# EAGLE design micro_RevB-328 (EAGLE 6.5.0)
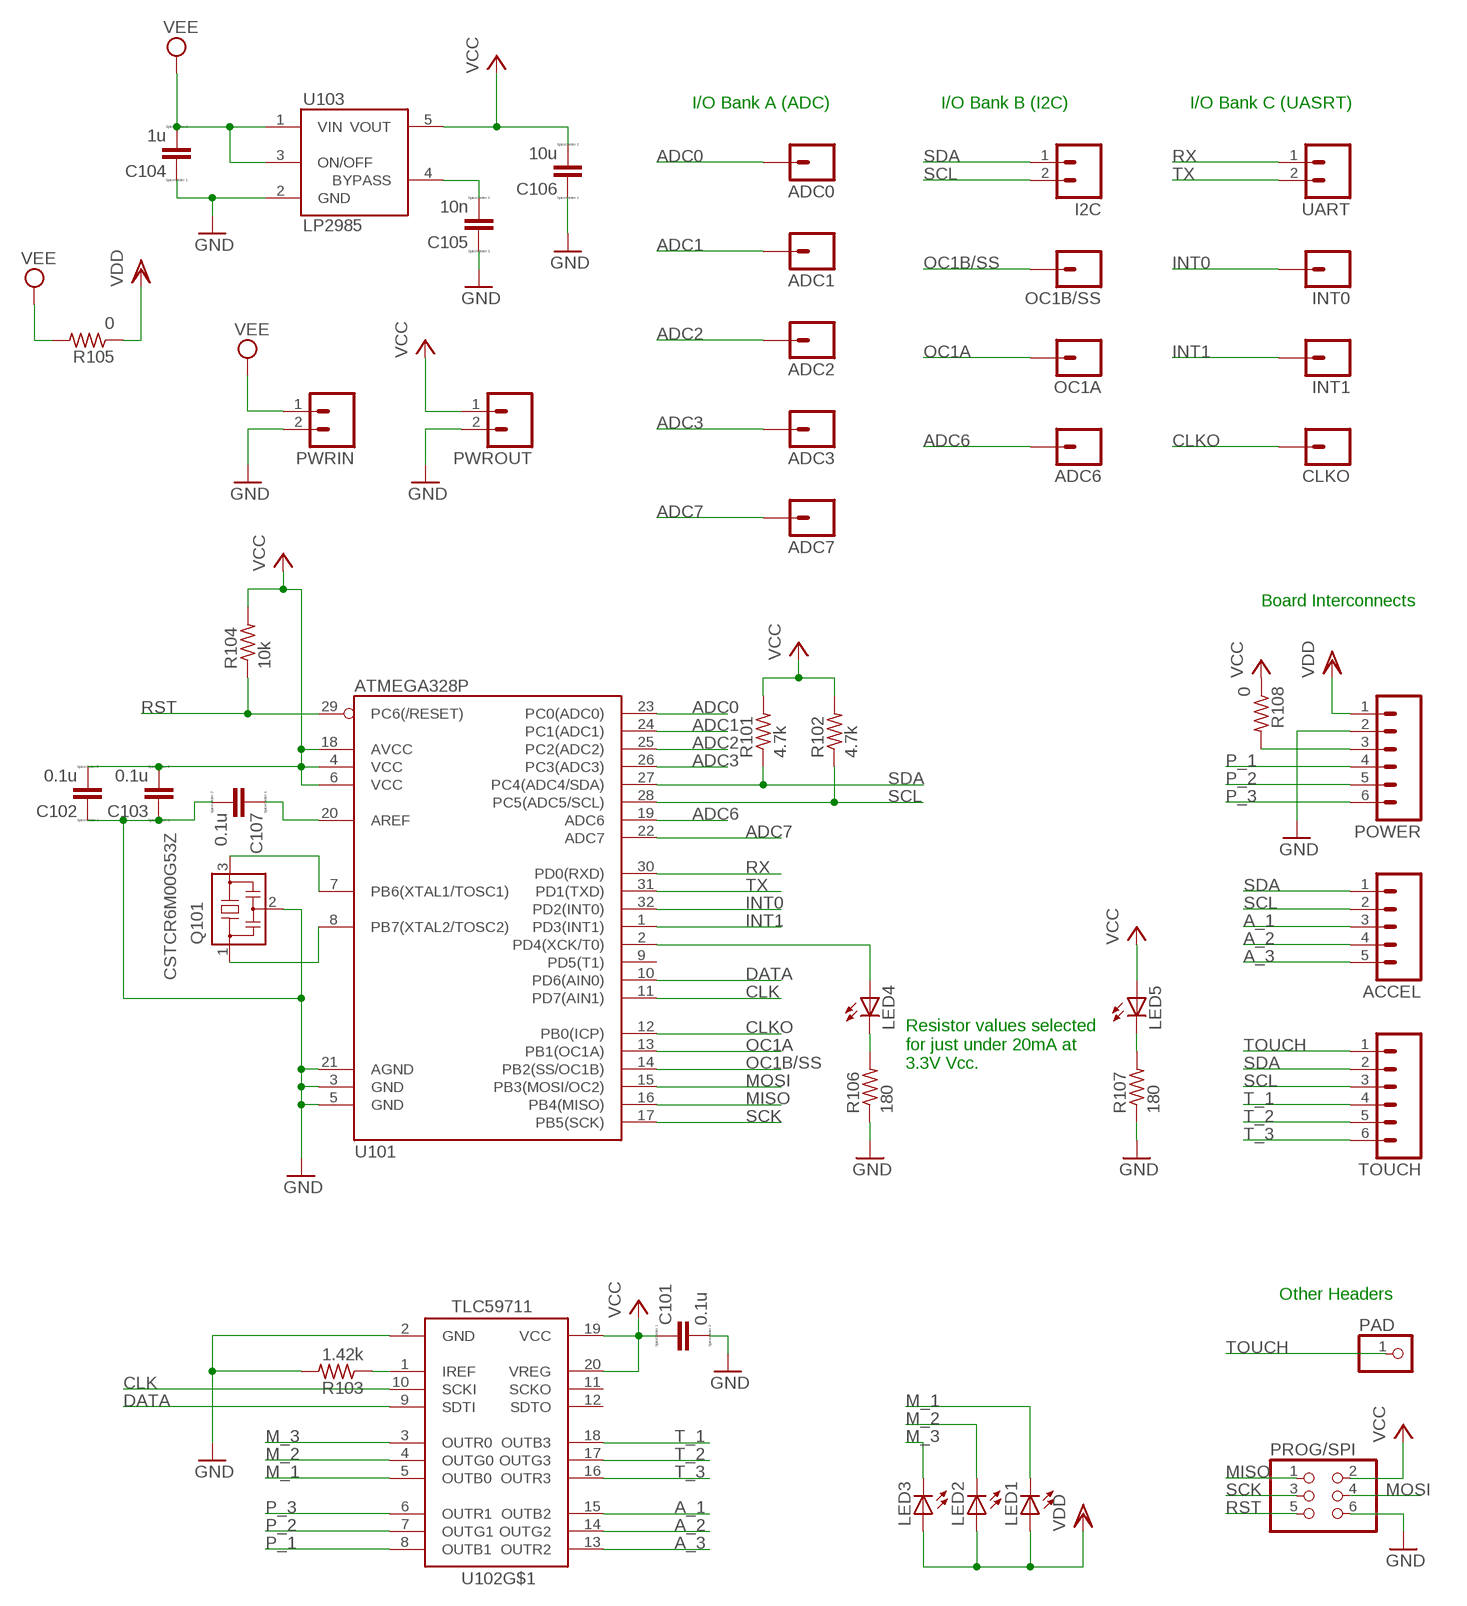
[diagram p0: schematic, sheet 1]

## Parts
ACCEL  M05LOCK  [1X05_LOCK]
ADC0  M01PTH  [1X01]
ADC1  M01PTH  [1X01]
ADC2  M01PTH  [1X01]
ADC3  M01PTH  [1X01]
ADC6  M01PTH  [1X01]
ADC7  M01PTH  [1X01]
C101  0.1u  CC0603  [C0603]
C102  0.1u  CC0603  [C0603]
C103  0.1u  CC0603  [C0603]
C104  1u  CC0603  [C0603]
C105  10n  CC0603  [C0603]
C106  10u  CC0603  [C0603]
C107  0.1u  CC0603  [C0603]
CLKO  M01PTH  [1X01]
I2C  M02LOCK  [1X02_LOCK]
INT0  M01PTH  [1X01]
INT1  M01PTH  [1X01]
LED1  LEDP-LCC-4  [P-LCC-4]
LED2  LEDP-LCC-4  [P-LCC-4]
LED3  LEDP-LCC-4  [P-LCC-4]
LED4  LEDSML0603  [SML0603]
LED5  LEDSML0603  [SML0603]
OC1A  M01PTH  [1X01]
OC1B/SS  M01PTH  [1X01]
PAD  PINHD-1X1  [1X01]
POWER  M06SIP_LOCK  [1X06-SIP_LOCK]
PROG/SPI  PINHD-2X3  [2X03]
PWRIN  M02LOCK  [1X02_LOCK]
PWROUT  M02LOCK  [1X02_LOCK]
Q101  CSTCR6M00G53Z  [CSTCR6M]
R101  4.7k  R-US_R0603  [R0603]
R102  4.7k  R-US_R0603  [R0603]
R103  1.42k  R-US_R0603  [R0603]
R104  10k  R-US_R0603  [R0603]
R105  0  R-US_R0603  [R0603]
R106  180  R-US_R0603  [R0603]
R107  180  R-US_R0603  [R0603]
R108  0  R-US_R0603  [R0603]
TOUCH  M06SIP_LOCK  [1X06-SIP_LOCK]
U101  ATMEGA328P  ATMEGA328_SMT  [TQFP32-08]
U102  TLC59711  [HTSSOP20DAP]
U103  LP2985AIM5-3.3  [SOT25]
UART  M02LOCK  [1X02_LOCK]

## Nets
A_1: ACCEL.3 U102.15(OUTB2)
A_2: ACCEL.4 U102.14(OUTG2)
A_3: ACCEL.5 U102.13(OUTR2)
ADC0: ADC0.1 U101.23(PC0(ADC0))
ADC1: ADC1.1 U101.24(PC1(ADC1))
ADC2: ADC2.1 U101.25(PC2(ADC2))
ADC3: ADC3.1 U101.26(PC3(ADC3))
ADC6: ADC6.1 U101.19(ADC6)
ADC7: ADC7.1 U101.22(ADC7)
BYPASS: C105.2 U103.4(BYPASS)
CLK: U101.11(PD7(AIN1)) U102.10(SCKI)
CLKO: CLKO.1 U101.12(PB0(ICP))
DATA: U101.10(PD6(AIN0)) U102.9(SDTI)
INT0: INT0.1 U101.32(PD2(INT0))
INT1: INT1.1 U101.1(PD3(INT1))
M_1: LED1.C@4(C) U102.5(OUTB0)
M_2: LED2.C@4(C) U102.4(OUTG0)
M_3: LED3.C@4(C) U102.3(OUTR0)
MISO: PROG/SPI.1 U101.16(PB4(MISO))
MOSI: PROG/SPI.4 U101.15(PB3(MOSI/OC2))
N7: C101.2 C102.1 C103.1 C104.1 C105.1 C106.1 C107.2 POWER.2 PROG/SPI.6 PWRIN.2 PWROUT.2 Q101.2 R103.2 R106.1 R107.1 U101.3(GND) U101.5(GND) U101.21(AGND) U102.2(GND) U103.2(GND) ; supply symbol labelled GND
N$1: Q101.1 U101.8(PB7(XTAL2/TOSC2))
N$2: Q101.3 U101.7(PB6(XTAL1/TOSC1))
N$3: LED4.A U101.2(PD4(XCK/T0))
N$4: R103.1 U102.1(IREF)
N$5: POWER.3 R108.2
N$8: LED4.C R106.2
N$10: C107.1 U101.20(AREF)
N$12: LED5.C R107.2
OC1A: OC1A.1 U101.13(PB1(OC1A))
OC1B/SS: OC1B/SS.1 U101.14(PB2(SS/OC1B))
P_1: POWER.4 U102.8(OUTB1)
P_2: POWER.5 U102.7(OUTG1)
P_3: POWER.6 U102.6(OUTR1)
RST: PROG/SPI.5 R104.1 U101.29(PC6(/RESET))
RX: U101.30(PD0(RXD)) UART.1
SCK: PROG/SPI.3 U101.17(PB5(SCK))
SCL: ACCEL.2 I2C.2 R102.1 TOUCH.3 U101.28(PC5(ADC5/SCL))
SDA: ACCEL.1 I2C.1 R101.1 TOUCH.2 U101.27(PC4(ADC4/SDA))
T_1: TOUCH.4 U102.18(OUTB3)
T_2: TOUCH.5 U102.17(OUTG3)
T_3: TOUCH.6 U102.16(OUTR3)
TOUCH: PAD.1 TOUCH.1
TX: U101.31(PD1(TXD)) UART.2
VCC: C101.1 C102.2 C103.2 C106.2 LED5.A PROG/SPI.2 PWROUT.1 R101.2 R102.2 R104.2 R108.1 U101.4(VCC) U101.6(VCC) U101.18(AVCC) U102.19(VCC) U102.20(VREG) U103.5(VOUT)
VDD: LED1.A LED2.A LED3.A POWER.1 R105.1
VEE: C104.2 PWRIN.1 R105.2 U103.1(VIN) U103.3(ON/OFF)
Unconnected: U101.9(PD5(T1)) U102.11(SCKO) U102.12(SDTO) U102.EXP(PAD)

## Notes on the sheet
- I/O Bank A (ADC) | I/O Bank B (I2C) | I/O Bank C (UASRT)
- Board Interconnects
- Resistor values selected 
  for just under 20mA at 
  3.3V Vcc.
- Other Headers

## Library data of the parts
ACCEL = SparkFun-Connectors:M05: Header 5 Standard 5-pin 0.1" header. Use with straight break away headers (SKU : PRT-00116), right angle break away headers (PRT-00553), swiss pins (PRT-00743), machine pins (PRT-00117), and female headers (PRT-00115). Molex polarized connector foot print use with SKU : PRT-08230 with associated crimp pins and housings.
ADC0 ADC1-ADC3 ADC6 ADC7 CLKO INT0 INT1 OC1A OC1B/SS = SparkFun-Connectors:M01: Header 1 Standard 1-pin 0.1" header. Use with straight break away headers (SKU : PRT-00116), right angle break away headers (PRT-00553), swiss pins (PRT-00743), machine pins (PRT-00117), and female headers (PRT-00115).
C101-C107 = eagle-ltspice:C: CAPACITOR, European symbol; SPICEMODEL: NONE; SPICEPREFIX: C
I2C PWRIN PWROUT UART = SparkFun-Connectors:M02: Standard 2-pin 0.1" header. Use with - straight break away headers ( PRT-00116) - right angle break away headers (PRT-00553) - swiss pins (PRT-00743) - machine pins (PRT-00117) - female headers (PRT-00115) Molex polarized connector foot print use with: PRT-08233 with associated crimp pins and housings. 2.54_SCREWTERM for use with PRT-10571. 3.5mm Screw Terminal footprints for PRT-08084 5mm Screw Terminal footprints for use with PRT-08433
LED1-LED5 = led:LED: LED OSRAM: - CHIPLED LG R971, LG N971, LY N971, LG Q971, LY Q971, LO R971, LY R971 LH N974, LH R974 LS Q976, LO Q976, LY Q976 LO Q996 - Hyper CHIPLED LW Q18S LB Q993, LB Q99A, LB R99A - SideLED LS A670, LO A670, LY A670, LG A670, LP A670 LB A673, LV A673, LT A673, LW A673 LH A674 LY A675 LS A676, LA A676, LO A676, LY A676, LW A676 LS A679, LY A679, LG A679 - Hyper Micro SIDELED® LS Y876, LA Y876, LO Y876, LY Y876 LT Y87S - SmartLED LW L88C, LW L88S LB L89C, LB L89S, LG L890 LS L89K, LO L89K, LY L89K LS L896, LA L896, LO L896, LY L896 - TOPLED LS T670, LO T670, LY T670, LG T670, LP T670 LSG T670, LSP T670, LSY T670, LOP T670, LYG T670 LG T671, LOG T671, LSG T671 LB T673, LV T673, LT T673, LW T673 LH T674 LS T676, LA T676, LO T676, LY T676, LB T676, LH T676, LSB T676, LW T676 LB T67C, LV T67C, LT T67C, LS T67K, LO T67K, LY T67K, LW E67C LS E67B, LA E67B, LO E67B, LY E67B, LB E67C, LV E67C, LT E67C LW T67C LS T679, LY T679, LG T679 LS T770, LO T770, LY T770, LG T770, LP T770 LB T773, LV T773, LT T773, LW T773 LH T774 LS E675, LA E675, LY E675, LS T675 LS T776, LA T776, LO T776, LY T776, LB T776 LHGB T686 LT T68C, LB T68C - Hyper Mini TOPLED® LB M676 - Mini TOPLED Santana® LG M470 LS M47K, LO M47K, LY M47K Source: http://www.osram.convergy.de LUXEON: - LUMILED® LXK2-PW12-R00, LXK2-PW12-S00, LXK2-PW14-U00, LXK2-PW14-V00 LXK2-PM12-R00, LXK2-PM12-S00, LXK2-PM14-U00 LXK2-PE12-Q00, LXK2-PE12-R00, LXK2-PE12-S00, LXK2-PE14-T00, LXK2-PE14-U00 LXK2-PB12-K00, LXK2-PB12-L00, LXK2-PB12-M00, LXK2-PB14-N00, LXK2-PB14-P00, LXK2-PB14-Q00 LXK2-PR12-L00, LXK2-PR12-M00, LXK2-PR14-Q00, LXK2-PR14-R00 LXK2-PD12-Q00, LXK2-PD12-R00, LXK2-PD12-S00 LXK2-PH12-R00, LXK2-PH12-S00 LXK2-PL12-P00, LXK2-PL12-Q00, LXK2-PL12-R00 Source: www.luxeon.com KINGBRIGHT: KA-3528ASYC Source: www.kingbright.com
PAD = pinhead:PINHD-1X1: PIN HEADER
POWER TOUCH = SparkFun-Connectors:M06: Header 6 Standard 6-pin 0.1" header. Use with straight break away headers (SKU : PRT-00116), right angle break away headers (PRT-00553), swiss pins (PRT-00743), machine pins (PRT-00117), and female headers (PRT-00115). Molex polarized connector foot print use with SKU : PRT-08094 with associated crimp pins and housings. NOTES ON THE VARIANTS LOCK and LOCK_LONGPADS... This footprint was designed to help hold the alignment of a through-hole component (i.e. 6-pin header) while soldering it into place. You may notice that each hole has been shifted either up or down by 0.005 of an inch from it's more standard position (which is a perfectly straight line). This slight alteration caused the pins (the squares in the middle) to touch the edges of the holes. Because they are alternating, it causes a "brace" to hold the component in place. 0.005 has proven to be the perfect amount of "off-center" position when using our standard breakaway headers. Although looks a little odd when you look at the bare footprint, once you have a header in there, the alteration is very hard to notice. Also,if you push a header all the way into place, it is covered up entirely on the bottom side. This idea of altering the position of holes to aid alignment will be further integrated into the Sparkfun Library for other footprints. It can help hold any component with 3 or more connection pins.
PROG/SPI = SparkFun-Connectors:PINHD-2X3: PIN HEADER
Q101 = murata-filter:CSTCR: Resonator Source: murata.co.jp; MPN: CSTCR6M00G53-R0; OC_FARNELL: 1170434; OC_NEWARK: 25M8759
R101 R102 R104-R108 = rcl:R-US_: RESISTOR, American symbol
R103 = resistor:R-US_: RESISTOR, American symbol
U101 = SparkFun-DigitalIC:ATMEGA328_SMT: 32-Pin Atmega328 part Commonly used on Arduino compatible boards Available in QFP and QFN packages TQFP is IC-09069 QFN is non-stock; PROD_ID: IC-09069
U102 = adafruit:TLC59711
U103 = LP2985:LP2985: LP2985-N Micropower 150 mA Low-Noise Ultra Low-Dropout Regulator

## Board
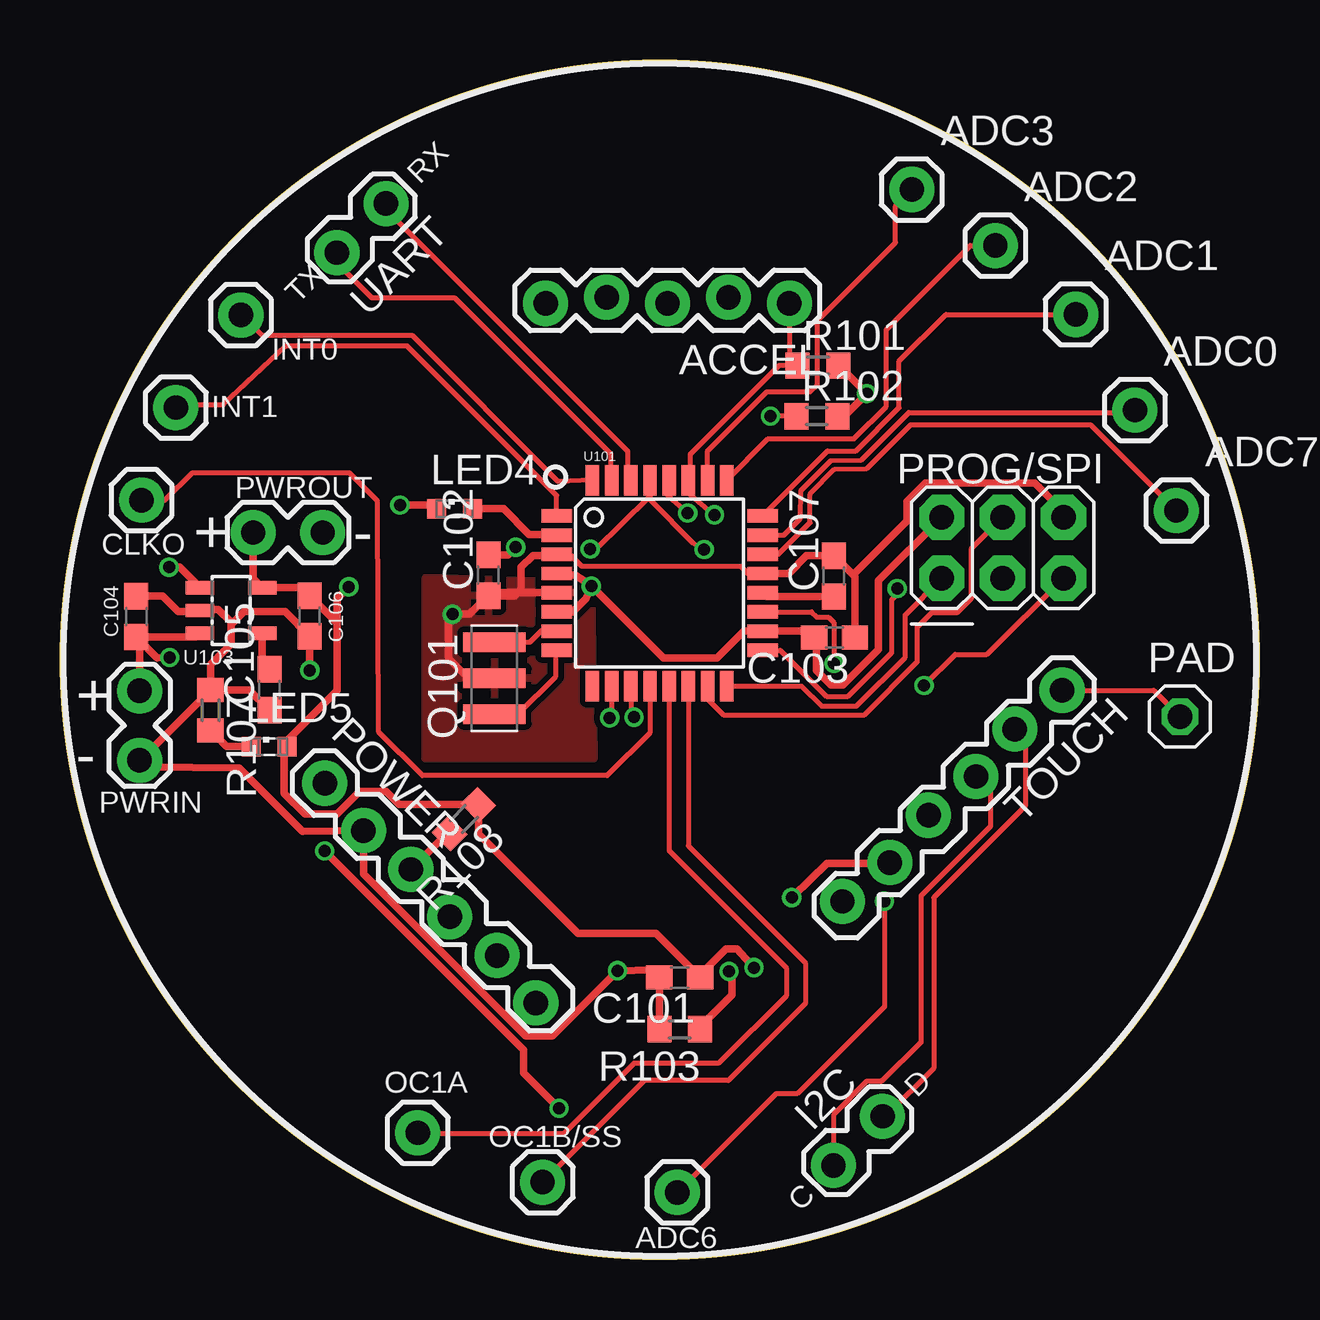
[diagram p1: board, top side]
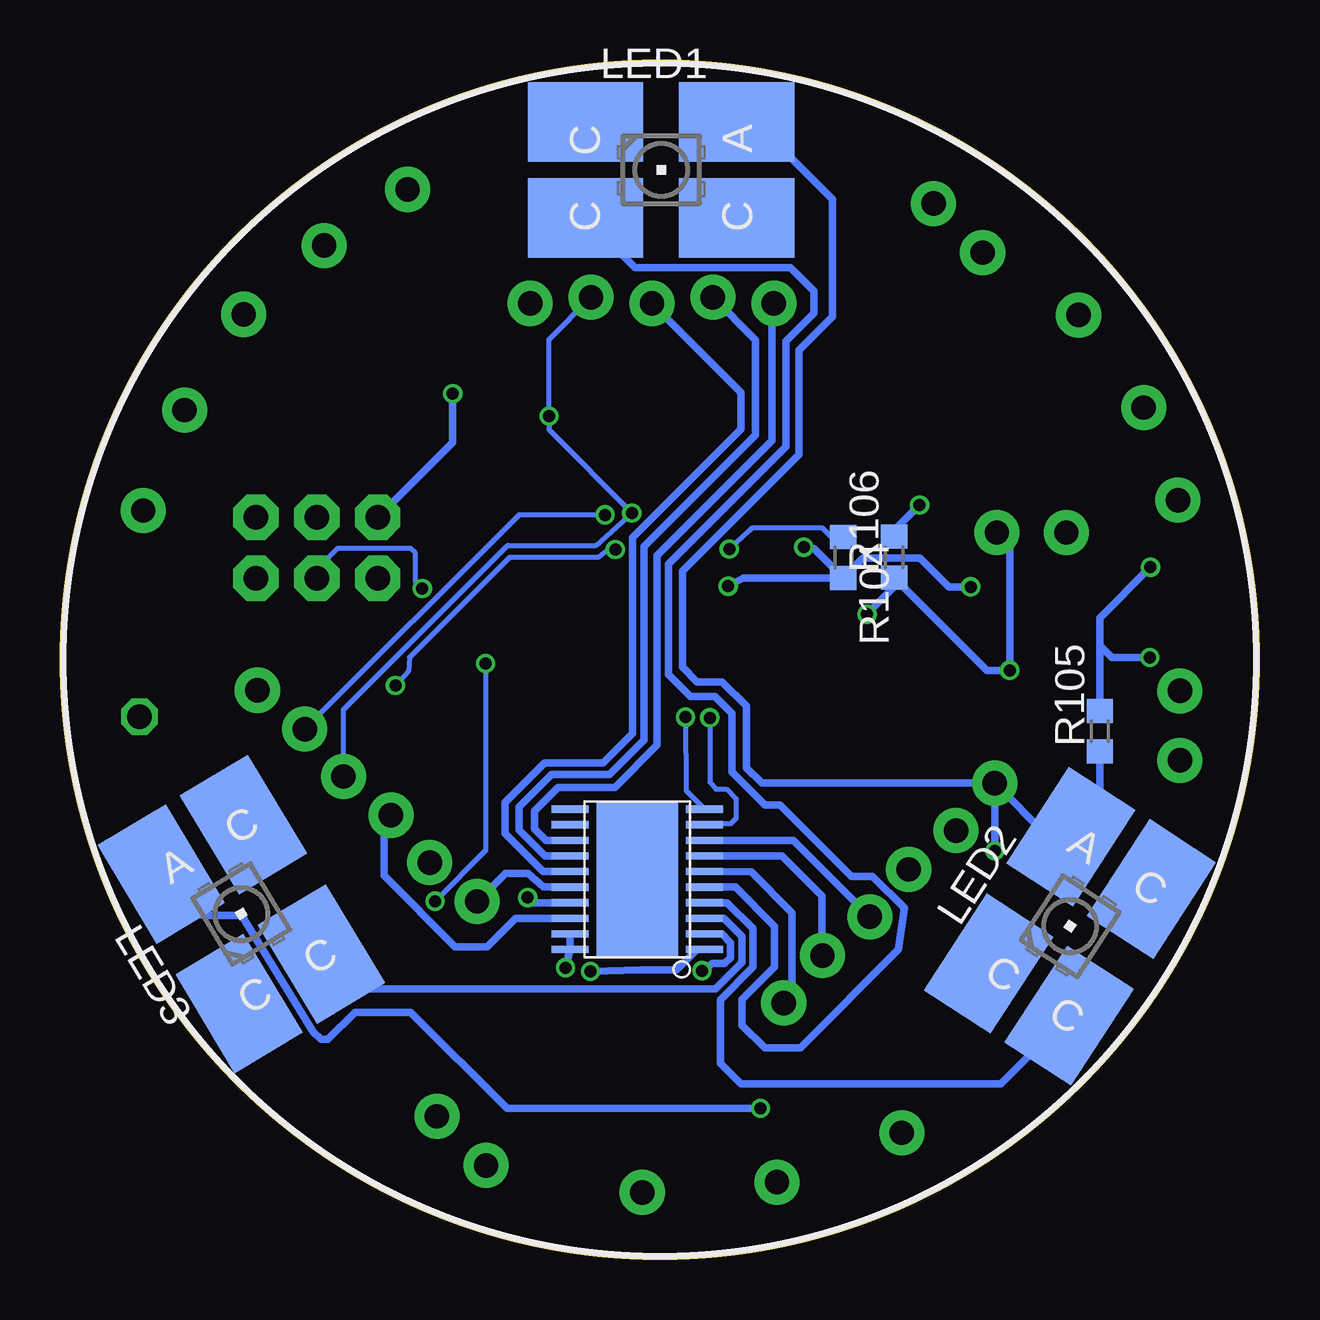
[diagram p2: board, bottom side, seen from below]

Size 50 x 50 mm. Coordinates in mm from the lower left corner, seen from the top.
Outline: circle at 25,25 radius 25
Copper layers (1*16): Top 0.035mm / dielectric 1.5mm / Bottom 0.035mm
Design rules "ITEADstudio_DRC": minimum track width 6mil, minimum drill 12mil, track to track 6mil, track to pad 6mil, pad to pad 6mil, via to via 6mil, smd to smd 0mil, copper to edge 10mil, drill to drill 10mil, minimum pad ring 10mil, minimum via ring 6mil, stop-mask expansion 2mil, vias tented up to drill 100mil, thermal gap 10mil

### Footprints (pad centres in the part's own frame; a part is rotated, then mirrored left to right if it is on the bottom)
1X05_LOCK = drill 1.016 pad 1.88: 1 0,0.127; 2 2.54,-0.127; 3 5.08,0.127; 4 7.62,-0.127; 5 10.16,0.127
1X01 = drill 1.016 pad 1.88: 1 0,0
C0603 = smd 1.1 x 1: 1 -0.85,0; 2 0.85,0
1X02_LOCK = drill 1.016 pad 1.88: 1 -0.178,0; 2 2.718,0
P-LCC-4 = smd 3.3 x 4.8: A -2,3.15; C@1 -2,-3.15; C@3 2,3.15; C@4 2,-3.15
SML0603 = smd 0.8 x 0.8: A 0.75,0; C -0.75,0
1X01' = drill 1.016 octagon: 1 0,0
1X06-SIP_LOCK = drill 1.016 pad 1.88: 1 0,0; 2 2.54,-0.254; 3 5.08,0; 4 7.62,-0.254; 5 10.16,0; 6 12.7,-0.254
2X03 = drill 1.016 pad 1.88 octagon: 1 -2.54,-1.27; 2 -2.54,1.27; 3 0,-1.27; 4 0,1.27; 5 2.54,-1.27; 6 2.54,1.27
CSTCR6M = smd 0.8 x 2.6: 1 -1.5,0; 2 0,0; 3 1.5,0
R0603 = smd 1 x 1.1: 1 -0.85,0; 2 0.85,0
TQFP32-08 = smd 1.27 x 0.559: 1 -4.293,2.8; 2 -4.293,2; 3 -4.293,1.2; 4 -4.293,0.4; 5 -4.293,-0.4; 6 -4.293,-1.2; 7 -4.293,-2; 8 -4.293,-2.8; 17 4.293,-2.8; 18 4.293,-2; 19 4.293,-1.2; 20 4.293,-0.4; 21 4.293,0.4; 22 4.293,1.2; 23 4.293,2; 24 4.293,2.8 | smd 0.559 x 1.27: 9 -2.8,-4.293; 10 -2,-4.293; 11 -1.2,-4.293; 12 -0.4,-4.293; 13 0.4,-4.293; 14 1.2,-4.293; 15 2,-4.293; 16 2.8,-4.293; 25 2.8,4.293; 26 2,4.293; 27 1.2,4.293; 28 0.4,4.293; 29 -0.4,4.293; 30 -1.2,4.293; 31 -2,4.293; 32 -2.8,4.293
HTSSOP20DAP = smd 0.3 x 1.55: 1 -2.925,-2.8; 2 -2.275,-2.8; 3 -1.625,-2.8; 4 -0.975,-2.8; 5 -0.325,-2.8; 6 0.325,-2.8; 7 0.975,-2.8; 8 1.625,-2.8; 9 2.275,-2.8; 10 2.925,-2.8; 11 2.925,2.8; 12 2.275,2.8; 13 1.625,2.8; 14 0.975,2.8; 15 0.325,2.8; 16 -0.325,2.8; 17 -0.975,2.8; 18 -1.625,2.8; 19 -2.275,2.8; 20 -2.925,2.8 | smd 6.5 x 3.4: EXP 0,0
SOT25 = smd 0.55 x 1.2: 1 -0.95,-1.3; 2 0,-1.3; 3 0.95,-1.3; 4 0.95,1.3; 5 -0.95,1.3

### Placement (x,y rotation side)
ACCEL  30.4,39.98 180 top
ADC0  44.81,35.41 0 top
ADC1  42.34,39.4 0 top
ADC2  38.99,42.27 0 top
ADC3  35.51,44.6 0 top
ADC6  25.73,2.79 0 top
ADC7  46.53,31.22 0 top
C101  25.83,11.76 180 top
C102  17.86,28.52 90 top
C103  32.28,25.93 180 top
C104  3.17,26.8 270 top
C105  8.74,23.75 90 top
C106  10.41,26.82 90 top
C107  32.26,28.48 90 top
CLKO  3.4,31.65 0 top
I2C  34.16,5.84 225 top
INT0  7.54,39.37 0 top
INT1  4.83,35.51 0 top
LED1  24.94,45.42 270 bottom
LED2  7.9,13.89 327 bottom
LED3  42.44,14.4 31 bottom
LED4  16.44,31.3 0 top
LED5  8.72,21.38 0 top
OC1A  14.91,5.28 0 top
OC1B/SS  20.12,3.23 0 top
PAD  [1X01']  46.69,22.63 0 top
POWER  11.03,19.85 315 top
PROG/SPI  39.29,29.67 0 top
PWRIN  3.32,23.53 270 top
PWROUT  8.23,30.3 0 top
Q101  18.11,24.23 90 top
R101  31.6,37.26 0 top
R102  31.55,35.15 0 top
R103  25.83,9.6 180 top
R104  17.35,29.26 270 bottom
R105  6.65,22.02 90 bottom
R106  15.23,29.28 90 bottom
R107  6.28,22.9 270 top
R108  16.84,18.36 225 top
TOUCH  41.77,23.73 225 top
U101  24.99,28.19 0 top
U102  25.93,15.85 90 bottom
U103  7.14,27.05 270 top
UART  13.46,43.89 225 top

### Tracks (layer width: path | path; a pad name or v marks a point on that pad's centre or on a via)
A_1
  Bottom 0.305: U102.15 29.86,16.18 31.45,17.75 31.45,19.05 29.79,20.7 27.36,20.7 26.14,21.92 26.14,30.1 21.61,34.62 21.61,36.14 ACCEL.3
A_2
  Bottom 0.305: U102.14 29.78,16.82 30.86,17.91 30.86,18.87 29.52,20.22 27.1,20.22 25.65,21.67 25.65,29.72 21.01,34.37 21.01,38.33 ACCEL.4
A_3
  Bottom 0.305: U102.13 29.74,17.48 30.23,17.96 30.23,18.69 29.23,19.68 26.87,19.68 25.12,21.44 25.12,29.34 20.32,34.14 20.32,39.78 ACCEL.5
ADC0
  Top 0.203: U101.23 30.17,30.19 30.86,30.89 30.89,32.05 32.13,33.3 33.4,33.33 35.38,35.31 44.7,35.31 ADC0.1
ADC1
  Top 0.203: U101.24 32,33.71 33.17,33.71 34.98,35.51 34.98,37.44 36.93,39.4 ADC1.1
ADC2
  Top 0.203: U101.25 29.52,34.21 33.1,34.21 34.44,35.56 34.44,38.76 37.95,42.27 ADC2.1
ADC3
  Top 0.203: U101.26 26.99,33.7 29.46,36.17 31.27,36.17 31.57,36.47 31.57,39.14 34.82,42.39 34.82,43.92 ADC3.1
ADC6  (via drill 0.5)
  Top 0.203: U101.19 31.32,26.99 31.55,26.77 32.03,26.77 32.26,26.54 v32.26,24.84 | v34.37,14.94 34.37,10.54 30.73,6.91 29.84,6.91 ADC6.1
  Bottom 0.203: v32.26,24.84 32.26,17.04 v34.37,14.94
ADC7
  Top 0.203: U101.22 29.93,29.39 31.27,30.71 31.27,31.9 32.28,32.94 33.63,32.97 35.46,34.8 42.95,34.8 ADC7.1
BYPASS
  Top 0.305: U103.4 8.44,24.9 C105.2
CLK  (via drill 0.5)
  Top 0.203: U101.11 23.79,22.89 v23.93,22.61
  Bottom 0.203: v23.93,22.61 23.9,19.54 U102.10
CLKO
  Top 0.203: U101.12 24.59,21.95 22.81,20.17 15.11,20.17 13.28,22 13.23,31.62 12.06,32.79 5.51,32.79 4.37,31.65 CLKO.1
DATA  (via drill 0.5)
  Top 0.203: U101.10 22.99,22.98 v22.91,22.58
  Bottom 0.203: v22.91,22.58 22.91,19.89 22.66,19.61 22.23,19.61 21.82,19.2 21.82,18.39 22.05,18.16 23.1,18.16 U102.9
INT0
  Top 0.203: U101.32 20.75,32.44 14.71,38.51 8.43,38.51 INT0.1
INT1
  Top 0.203: U101.1 20.7,31.85 14.48,38.08 9.4,38.08 6.78,35.61 4.93,35.61 INT1.1
M_1
  Bottom 0.305: U102.5 21.85,15.53 20.22,13.89 20.22,12.19 21.57,10.85 21.57,9.75 20.62,8.81 19.13,8.81 15.06,12.93 14.81,14.66 16.13,15.98 17.02,15.98 19.99,18.95 20.62,18.95 22,20.32 22,22.76 22.71,23.47 23.72,23.47 24.64,24.38 24.64,28.98 19.74,33.88 19.74,38.28 18.57,39.45 18.57,40.36 19.56,41.35 26.03,41.35 LED1.C@4
M_2
  Bottom 0.305: U102.4 22.19,14.88 21.11,13.79 21.11,12.19 22.48,10.82 22.48,8.18 21.61,7.32 10.79,7.32 LED2.C@4
M_3
  Bottom 0.305: U102.3 22.33,14.22 21.57,13.46 21.57,12.39 22.68,11.28 37.65,11.28 LED3.C@4
MISO
  Top 0.203: U101.16 30.91,23.9 31.75,23.06 33.2,23.06 35.23,25.09 35.23,26.87 PROG/SPI.1
MOSI
  Top 0.203: U101.15 26.99,23.38 27.66,22.71 33.53,22.71 35.74,24.92 35.74,26.36 36.35,26.98 37.41,26.98 38,27.56 38,29.64 PROG/SPI.4
N7  (via drill 0.5)
  Top 0.203: U101.3 21.25,29.39 21.74,28.91 28.37,28.91 28.7,28.57 29.27,28.57 U101.21 | 41.83,31.17 PROG/SPI.6
  Top 0.305: R103.2 C101.2 24.68,12.06 v23.24,12.04 20.52,9.32 19.41,9.32 12.65,16.08 POWER.2 10.11,17.85 7.47,20.5 3.6,20.52 PWRIN.2 3.33,20.81 R107.1 | C103.1 33.13,28.46 33.05,28.55 | 33.05,28.55 C107.2 31.11,29.33 30.38,28.6 U101.21 | C104.1 4.28,27.65 4.93,27 5.79,27 U103.2 5.89,27.1 6.6,27.1 7.14,26.57 7.14,26.47 | R107.1 7.89,23.75 C105.1 | R107.1 6.28,24.79 7.14,25.65 7.14,26.47 | 7.14,26.47 7.67,27 9.39,27 C106.1 v10.41,24.56 | C102.1 17.08,26.9 v16.36,26.9 16.2,26.75 16.2,25.04 17.02,24.23 Q101.2 | U101.5 18.17,27.79 18.03,27.66 18.95,27.66 19.23,27.94 19.23,28.85 19.71,29.34 20.64,29.34 U101.3 | 41.83,31.17 40.64,32.36 36.07,32.36 35.31,31.6 35.31,30.79 33.07,28.55 33.05,28.55
  Bottom 0.305: U102.2 22.41,13.57 22.05,13.21 22.05,12.57 22.3,12.34 22.81,12.34 v23.24,12.04 | v16.36,26.9 15.23,28.02 R106.1 11.37,24.56 v10.41,24.56 10.41,29.77 PWROUT.2
  pour Top (isolate 0.254): 15.24,28.42 22.15,28.22 22.25,20.88 15.21,20.88 15.21,28.35
N$1
  Top 0.203: Q101.1 19.1,22.73 20.68,24.31 20.68,25.37 U101.8
N$2
  Top 0.203: Q101.3 19.59,25.73 20.07,26.21 20.68,26.21 U101.7
N$3
  Top 0.305: LED4.A 18.49,31.3 19.56,30.23 20.67,30.23 U101.2
N$4  (via drill 0.5)
  Top 0.305: v27.89,12.01 28.02,12.09 28.02,11.02 26.81,9.83 R103.1
  Bottom 0.305: U102.1 23.45,12.93 24.31,12.06 25.78,12.06 v27.89,12.01
N$5
  Top 0.305: POWER.3 16.13,17.76 R108.2
N$8  (via drill 0.5)
  Top 0.305: LED4.C 15.54,31.45 v14.17,31.45
  Bottom 0.305: v14.17,31.45 15.23,30.39 R106.2
N$10
  Top 0.305: C107.1 29.45,27.63 U101.20
N$12
  Top 0.305: LED5.C 6.95,21.38 R107.2
OC1A
  Top 0.203: U101.13 25.39,17.05 30.28,12.17 30.28,11 27.46,8.18 23.93,8.18 20.98,5.23 14.96,5.23 OC1A.1
OC1B/SS
  Top 0.203: U101.14 26.19,17.24 31.06,12.37 31.06,10.67 27.86,7.47 24.36,7.47 OC1B/SS.1
P_1
  Bottom 0.305: U102.8 19.43,17.48 POWER.4
P_2
  Bottom 0.305: U102.7 19.9,16.82 18.24,15.16 18.24,14.48 POWER.5
P_3
  Bottom 0.305: U102.6 21.18,16.15 19.48,14.45 19.48,10.88 POWER.6
RST  (via drill 0.5)
  Top 0.203: v22.1,29.62 22.35,29.62 24.56,31.77 24.56,32.45 U101.29 24.59,31.67 26.39,29.87 v26.85,29.59 | v36.02,23.93 37.31,25.22 38.63,25.22 PROG/SPI.5
  Bottom 0.203: v22.1,29.62 21.27,30.36 21.16,30.48 18.21,30.48 17.84,30.11 R104.1 | v26.85,29.59 27.23,29.54 27.56,29.26 31.27,29.26 35.43,25.09 35.46,24.54 v36.02,23.93
RX
  Top 0.203: U101.30 23.67,32.61 23.67,33.68 13.59,43.77 UART.1
SCK  (via drill 0.5)
  Top 0.203: U101.17 30.03,25.39 31.95,23.47 32.84,23.47 34.67,25.3 34.67,27.51 34.9,27.74 v34.9,27.96
  Bottom 0.203: v34.9,27.96 35.18,28.25 35.18,29.44 35.38,29.64 38.43,29.64 39.29,28.78 PROG/SPI.3
SCL  (via drill 0.5)
  Top 0.203: v26.16,31.11 25.35,31.83 25.35,32.44 U101.28 | R102.1 v29.62,35.15 | TOUCH.3 38.79,19.53 38.79,18.06 35.89,15.16 35.89,9.04 34.24,7.42 33.6,7.42 32.24,6.03 I2C.2
  Bottom 0.203: TOUCH.3 38.18,22.93 31.34,29.77 27.66,29.77 v26.16,31.11 29.62,34.59 v29.62,35.15 29.62,38.35 ACCEL.2
SDA  (via drill 0.5)
  Top 0.203: v27.28,31.04 26.19,31.95 U101.27 26.26,32.56 26.26,33.55 29.97,37.26 R101.1 30.4,37.61 ACCEL.1 | TOUCH.2 40.23,21.68 40.23,18.9 36.42,15.09 36.42,7.98 34.42,5.97 I2C.1
  Bottom 0.203: v27.28,31.04 30.87,31.04 TOUCH.2
T_1
  Bottom 0.305: U102.18 31.01,14.22 32.21,13.03 33.53,13.03 36.5,16 36.5,18.22 TOUCH.4
T_2  (via drill 0.5)
  Top 0.305: v30.5,15.09 30.56,15.14 31.98,16.51 34.55,16.51 TOUCH.5
  Bottom 0.305: U102.17 30.24,14.88 v30.5,15.09
T_3
  Bottom 0.305: U102.16 29.85,15.53 30.48,16.1 31.44,16.1 TOUCH.6
TOUCH
  Top 0.203: TOUCH.1 45.59,23.73 PAD.1
TX
  Top 0.203: U101.31 22.96,32.52 22.96,33.58 16.46,40.08 13.01,40.08 11.54,41.55 UART.2
VCC  (via drill 0.5)
  Top 0.305: v28.93,12.17 28.22,12.95 27.76,12.95 26.68,11.87 C101.1 24.85,13.59 21.59,13.59 17.44,17.74 R108.1 14.13,18.96 13.59,19.51 12.5,19.51 11.56,18.57 10.21,18.57 9.35,19.43 9.35,21.25 LED5.A 9.47,21.64 11.56,23.72 11.56,26.53 | 11.56,26.53 C106.2 10.09,28 U103.5 8.05,28.39 PWROUT.1 | U101.6 21.36,26.99 21.92,27.56 v22.15,28.07 | v22.15,28.07 22.1,28.14 21.46,28.52 20.77,28.52 U101.4 | 11.56,26.53 11.56,27.56 v12.04,28.04 | C102.2 18.68,29.37 v19,29.69 | v22.15,28.07 25.15,25.07 27.38,25.07 28.5,26.19 U101.18 31.17,26.19 C103.2 31.52,25.84 31.52,24.56 32.13,23.95 32.64,23.95 34.11,25.43 34.11,28.3 PROG/SPI.2 | R101.2 v33.63,36.09 32.69,35.15 R102.2
  Bottom 0.305: U102.19 U102.20 28.93,12.14 v28.93,12.17 | v12.04,28.04 12.95,28.04 14.15,29.23 16.52,29.23 R104.2 | R104.2 21.5,28.41 v22.15,28.07 | v19,29.69 18.58,29.64 R104.2 | PROG/SPI.2 33.63,34.06 v33.63,36.09
VDD  (via drill 0.5)
  Top 0.305: v11.03,17.03 19.33,8.74 19.33,7.77 v20.8,6.3
  Bottom 0.305: POWER.1 8.8,17.62 LED2.A 6.66,18.83 R105.1 | v20.8,6.3 31.37,6.3 35.38,10.31 37.69,10.31 38.84,9.17 39.12,9.17 39.45,9.5 42.42,14.35 44.06,14.35 LED3.A | v11.03,17.03 POWER.1 | POWER.1 20.74,19.85 21.39,20.5 21.39,23.06 22.4,24.08 23.44,24.08 24.05,24.69 24.05,28.7 19.2,33.55 19.2,37.9 17.8,39.29 17.8,44.2 20.22,46.61 20.99,46.61 LED1.A
VEE  (via drill 0.5)
  Top 0.305: PWRIN.1 3.31,25.81 C104.2 | C104.2 5.68,25.95 U103.3 | v4.55,28.85 4.98,28.85 U103.1 | v4.57,25.09 4.05,25.07 C104.2
  Bottom 0.305: R105.2 6.66,25.6 | v4.55,28.85 6.66,26.75 6.66,25.6 | 6.66,25.6 6.15,25.09 v4.57,25.09

### Text on the board
tPlace: RX | TX | + | - | U103 | + | - | D | C